# EAGLE board vr99-revA (EAGLE 9.6.2), part 1 of 5
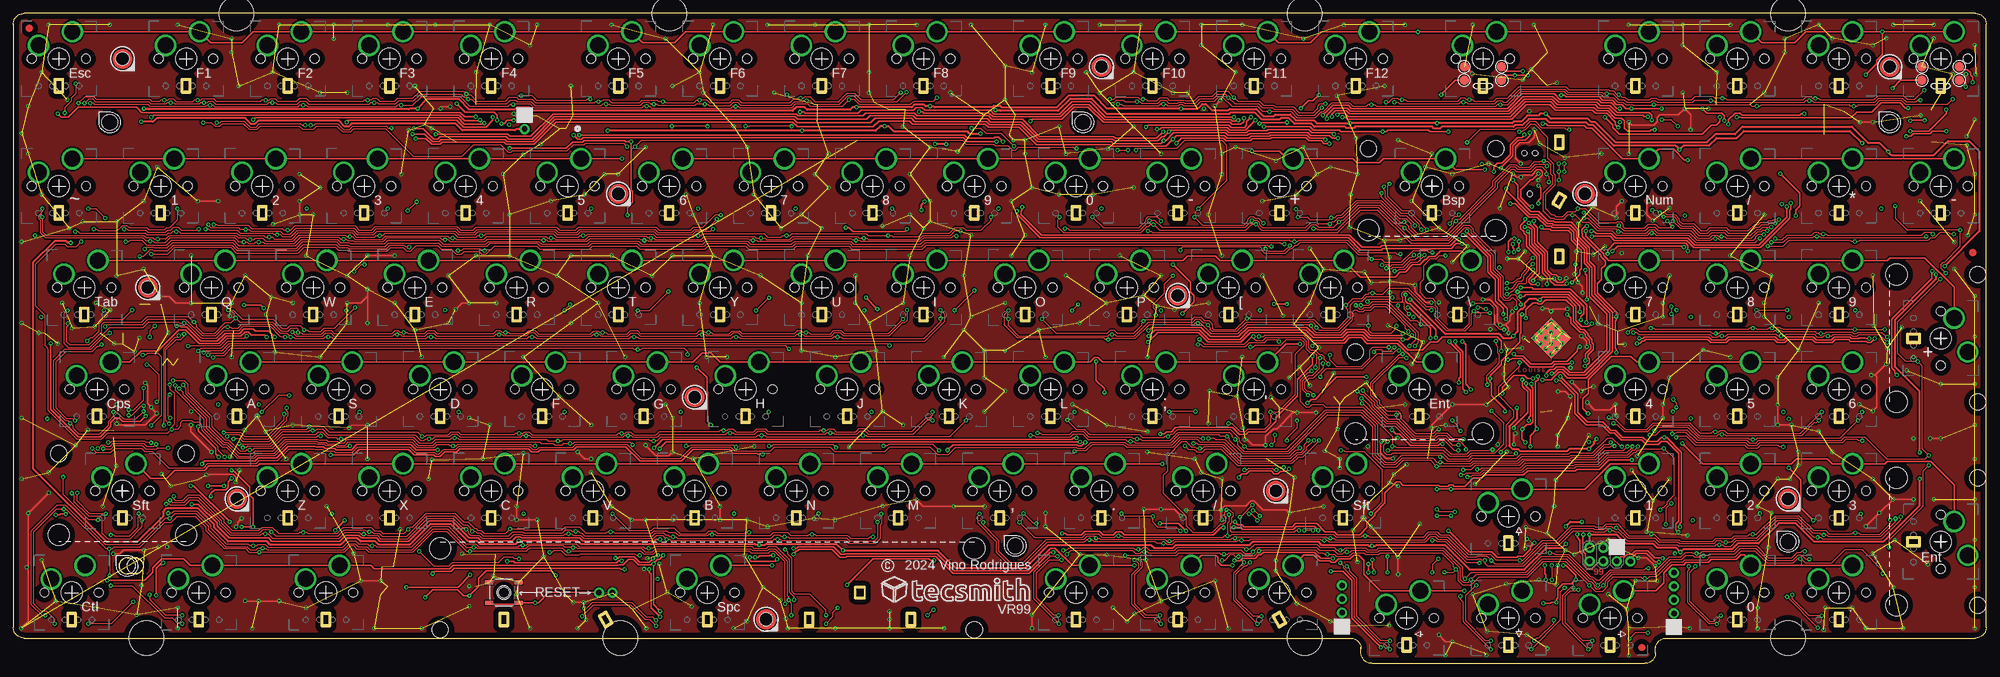
[diagram p4: board, top side]
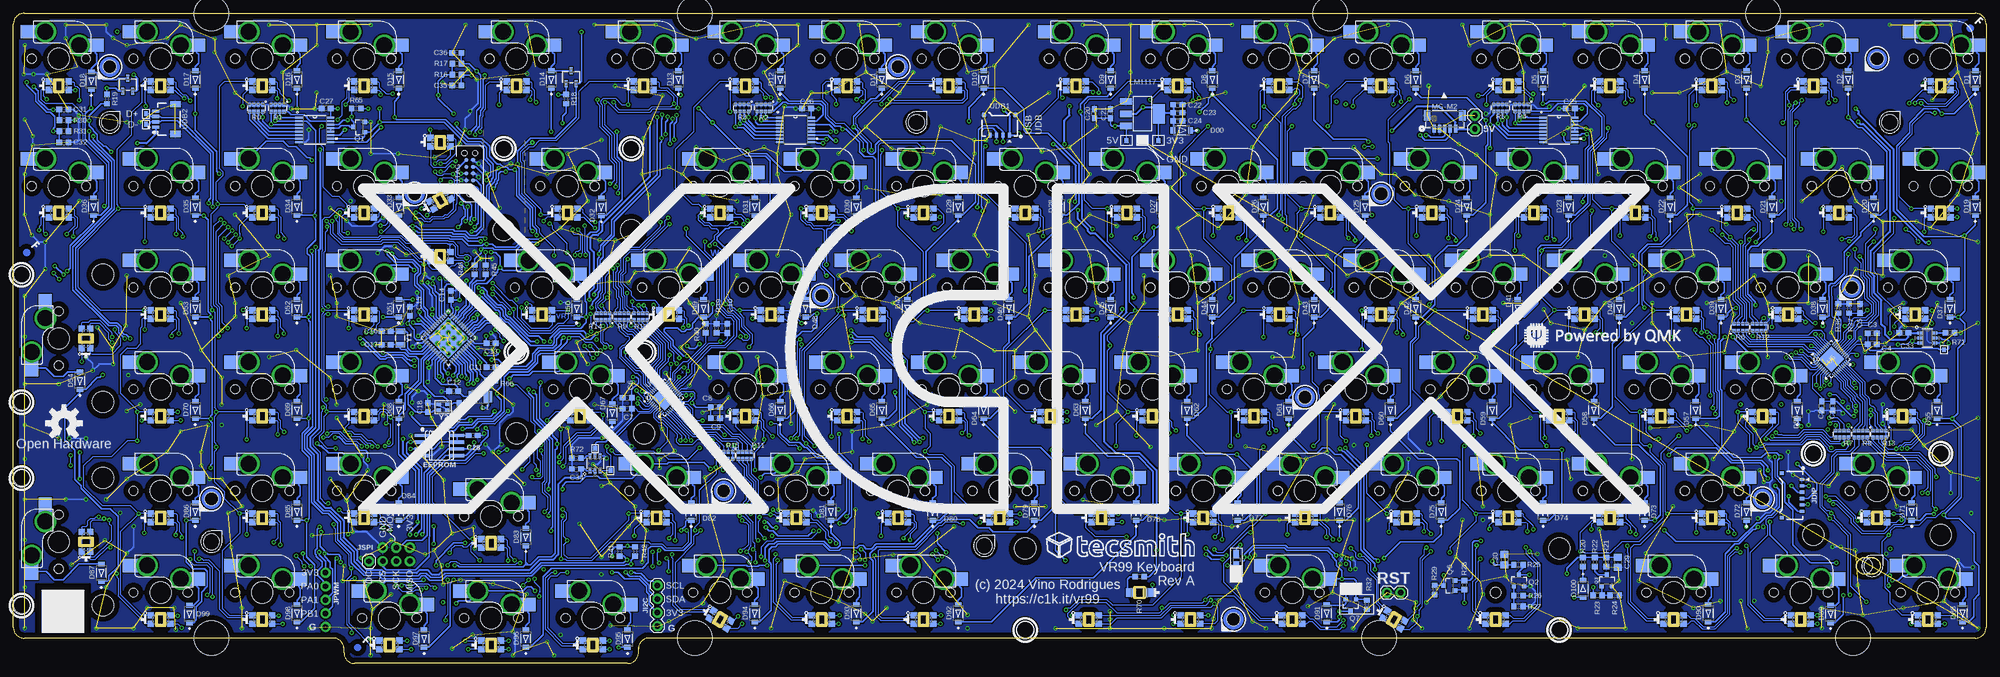
[diagram p5: board, bottom side, seen from below]

Size 369.48 x 121.83 mm. Coordinates in mm from the lower left corner, seen from the top.
Outline: 252.41,2.76 252.41,2 arc90 254.41,0 305.56,0 arc90 307.56,2 307.56,2.76
Outline: 252.41,2.76 252.41,3
Outline: 307.56,2.76 307.56,3
Outline: 307.56,2.76 arc-90 309.56,4.76 367.48,4.76 arc90 369.48,6.76 369.48,119.83 arc90 367.48,121.83 2,121.83 arc90 0,119.83 0,6.76 arc90 2,4.76 250.41,4.76 arc-90 252.41,2.76
Outline: 22.81,16.79 21.31,16.79 arc-180 21.31,19.79 22.81,19.79 arc-180 22.81,16.79
Copper layers (1*16): Top 0.035mm / dielectric 1.5mm / Bottom 0.035mm
Design rules "default *": minimum track width 6mil, minimum drill 0.35mm, track to track 9.5mil, track to pad 9.5mil, pad to pad 9.5mil, via to via 9.5mil, smd to smd 9.5mil, copper to edge 40mil, drill to drill 4mil, minimum pad ring 10mil, minimum via ring 8mil, stop-mask expansion 4mil, vias tented up to drill 0mil, thermal gap 9.5mil
Holes 6.5 mm at 332.38,121.8 241.89,121.8 122.83,121.8 41.83,121.8 332.38,4.79 241.89,4.79 113.72,4.79 24.97,4.79
Holes 2 mm at 91.87,13.29
Holes 3 mm at 22.81,18.29

## Footprints (pad centres in the part's own frame; a part is rotated, then mirrored left to right if it is on the bottom)
1X02 = drill 1.016 pad 1.88: 1 0,0; 2 2.54,0
C0603 = smd 1.1 x 1: 1 -0.85,0; 2 0.85,0
0603 = smd 1.1 x 1: 1 -0.85,0; 2 0.85,0
C0805 = smd 1.3 x 1.5: 1 -0.95,0; 2 0.95,0
SOD-123 = smd 0.914 x 1.219: A 1.638,0; C -1.638,0
LED-RM-MILL = smd 1.5 x 1.6: A 1.8,0; C -1.8,0
8-SOIC-SO8_N_W_DUAL = smd 0.6 x 2.731: 1 -1.905,-3.29; 2 -0.635,-3.29; 3 0.635,-3.29; 4 1.905,-3.29; 5 1.905,3.29; 6 0.635,3.29; 7 -0.635,3.29; 8 -1.905,3.29
MGEEK-M2-HOLE = hole 3: 0,0
BRUTAL-1800-HOLE = hole 2.5: 0,0
MX-STABS-200U = hole 3.988: -11.938,8.255; 11.938,8.255 | hole 3.048: -11.938,-6.985; 11.938,-6.985
MX-STABS-625U = hole 3.988: -50,8.255; 50,8.255 | hole 3.048: -50,-6.985; 50,-6.985
MOLEX_781710006 = smd 0.6 x 0.85: 1 -3,2; 2 -1.8,2; 3 -0.6,2; 4 0.6,2; 5 1.8,2; 6 3,2 | smd 0.7 x 0.8: NC1 -4.15,-1.775; NC2 4.15,-1.775
1X04 = drill 1.016 pad 1.88: 1 0,0; 2 2.54,0; 3 5.08,0; 4 7.62,0
1X05_NO_SILK = drill 1.016 pad 1.88: 1 0,0; 2 2.54,0; 3 5.08,0; 4 7.62,0; 5 10.16,0
2X3-NS = drill 1.016 pad 1.88: 1 -2.54,-1.27; 2 -2.54,1.27; 3 0,-1.27; 4 0,1.27; 5 2.54,-1.27; 6 2.54,1.27
1X01 = drill 1.016 pad 1.88: 1 0,0
TC2050-IDC-NL = smd 0.787 x 0.787: 1 1.27,-0.635; 2 2.54,-0.635; 3 3.81,-0.635; 4 5.08,-0.635; 5 6.35,-0.635; 6 6.35,0.635; 7 5.08,0.635; 8 3.81,0.635; 9 2.54,0.635; 10 1.27,0.635 | hole 1: 0,0; 7.62,-1.016; 7.62,1.016
L3225M = smd 1.6 x 2.2: 1 -1.4,0; 2 1.4,0
SOT223 = smd 1.219 x 2.235: 1 -2.311,-3.099; 2 0,-3.099; 3 2.311,-3.099 | smd 3.6 x 2.2: 4 0,3.099
CONN5_SM05B-SRSS_JST = smd 0.66 x 1.549: 1 -2,-1.772; 2 -1,-1.772; 3 0,-1.772; 4 1,-1.772; 5 2,-1.772 | smd 1.295 x 1.905: 6 -3.3,0.698; 7 3.3,0.698
SOT23-3 = smd 0.8 x 0.9: 1 -0.95,-1; 2 0.95,-1; 3 0,1.1
SOT-23-3L_AOS = smd 0.559 x 1.321: 1 -0.953,-1.194; 2 0.953,-1.194; 3 0,1.194
R0603X4 = smd 0.7 x 0.6: 1 -0.65,1.2; 2 -0.65,0.4; 3 -0.65,-0.4; 4 -0.65,-1.2; 5 0.65,-1.2; 6 0.65,-0.4; 7 0.65,0.4; 8 0.65,1.2
R0603 = smd 1 x 1.1: 1 -0.85,0; 2 0.85,0
R0805W = smd 1.5 x 1: 1 -1.052,0; 2 1.052,0
TACTILE_SWITCH_SMD_5.2MM = smd 1.524 x 0.762: 1 -2.794,1.905; 2 2.794,1.905; 3 -2.794,-1.905; 4 2.794,-1.905
MX-5-PIN-HOTSWAP-PAD = smd 3.15 x 2.5 bottom: 1@1 -6.785,2.54; 2@1 5.542,5.08 | drill 3 pad 3.75: 1@2 -3.81,2.54; 2@2 2.54,5.08 | hole 3.988: 0,0 | hole 1.7: -5.08,0; 5.08,0
MX-5-PIN-SKYLOONG-KNOB = smd 3.15 x 2.5 bottom: 1@1 -6.785,2.54; 2@1 5.542,5.08 | drill 3 pad 3.75: 1@2 -3.81,2.54; 2@2 2.54,5.08 | smd 1.75 x 1.75: A 3.5,-4; B 3.5,-1.5; C -3.5,-1.5; S -3.5,-4 | hole 3.988: 0,0 | hole 1.7: -5.08,0; 5.08,0
PAD.03X.03-SQ = smd 0.762 x 0.762: 1 0,0
UFQFPN-48_7X7X0P55MM-THERM = smd 0.813 x 0.305: 1 -3.454,2.75; 2 -3.454,2.25; 3 -3.454,1.75; 4 -3.454,1.25; 5 -3.454,0.75; 6 -3.454,0.25; 7 -3.454,-0.25; 8 -3.454,-0.75; 9 -3.454,-1.25; 10 -3.454,-1.75; 11 -3.454,-2.25; 12 -3.454,-2.75; 25 3.454,-2.75; 26 3.454,-2.25; 27 3.454,-1.75; 28 3.454,-1.25; 29 3.454,-0.75; 30 3.454,-0.25; 31 3.454,0.25; 32 3.454,0.75; 33 3.454,1.25; 34 3.454,1.75; 35 3.454,2.25; 36 3.454,2.75 | smd 0.305 x 0.813: 13 -2.75,-3.454; 14 -2.25,-3.454; 15 -1.75,-3.454; 16 -1.25,-3.454; 17 -0.75,-3.454; 18 -0.25,-3.454; 19 0.25,-3.454; 20 0.75,-3.454; 21 1.25,-3.454; 22 1.75,-3.454; 23 2.25,-3.454; 24 2.75,-3.454; 37 2.75,3.454; 38 2.25,3.454; 39 1.75,3.454; 40 1.25,3.454; 41 0.75,3.454; 42 0.25,3.454; 43 -0.25,3.454; 44 -0.75,3.454; 45 -1.25,3.454; 46 -1.75,3.454; 47 -2.25,3.454; 48 -2.75,3.454 | smd 5 x 5.4: 49 0.2,0 | smd 0.4 x 5: 49@1 -2.5,-0.2 | smd 0.56 x 0.29 rotated 45: 49@2 -2.4,2.4 | smd 5.4 x 5.4 bottom: 49@3 0,0 | drill 0.4: 49@4 -0.711,2.134; 49@5 0.711,2.134; 49@6 2.134,2.134; 49@7 -2.134,0.711; 49@8 -0.711,0.711; 49@9 0.711,0.711; 49@10 2.134,0.711; 49@11 -2.134,-0.711; 49@12 -0.711,-0.711; 49@13 0.711,-0.711; 49@14 2.134,-0.711; 49@15 -2.134,-2.134; 49@16 -0.711,-2.134; 49@17 0.711,-2.134; 49@18 2.134,-2.134
TSSOP16 = smd 1.408 x 0.356: 1 -2.952,2.275; 2 -2.952,1.625; 3 -2.952,0.975; 4 -2.952,0.325; 5 -2.952,-0.325; 6 -2.952,-0.975; 7 -2.952,-1.625; 8 -2.952,-2.275; 9 2.952,-2.275; 10 2.952,-1.625; 11 2.952,-0.975; 12 2.952,-0.325; 13 2.952,0.325; 14 2.952,0.975; 15 2.952,1.625; 16 2.952,2.275
UQFN40 = smd 0.813 x 0.203: 1 -2.4,1.8; 2 -2.4,1.4; 3 -2.4,1; 4 -2.4,0.6; 5 -2.4,0.2; 6 -2.4,-0.2; 7 -2.4,-0.6; 8 -2.4,-1; 9 -2.4,-1.4; 10 -2.4,-1.8; 21 2.4,-1.8; 22 2.4,-1.4; 23 2.4,-1; 24 2.4,-0.6; 25 2.4,-0.2; 26 2.4,0.2; 27 2.4,0.6; 28 2.4,1; 29 2.4,1.4; 30 2.4,1.8 | smd 0.203 x 0.813: 11 -1.8,-2.4; 12 -1.4,-2.4; 13 -1,-2.4; 14 -0.6,-2.4; 15 -0.2,-2.4; 16 0.2,-2.4; 17 0.6,-2.4; 18 1,-2.4; 19 1.4,-2.4; 20 1.8,-2.4; 31 1.8,2.4; 32 1.4,2.4; 33 1,2.4; 34 0.6,2.4; 35 0.2,2.4; 36 -0.2,2.4; 37 -0.6,2.4; 38 -1,2.4; 39 -1.4,2.4; 40 -1.8,2.4 | smd 3 x 3.4: EPAD 0.225,0 | smd 0.566 x 0.566 rotated 315: EPAD@1 -1.278,1.299 | smd 0.4 x 3: EPAD@2 -1.477,-0.2
SOT-23-THIN-6_DDC_TEX = smd 1.003 x 0.559: 1 -1.378,0.95; 2 -1.378,0; 3 -1.378,-0.95; 4 1.378,-0.95; 5 1.378,0; 6 1.378,0.95
MOLEX_781710004 = smd 0.6 x 0.85: 1 -1.8,2; 2 -0.6,2; 3 0.6,2; 4 1.8,2 | smd 0.7 x 0.8: NC1 -2.95,-1.775; NC2 2.95,-1.775
JST_SM04B-SRSS-TB_LF_SN = smd 0.6 x 1.35: 1 -1.5,0; 2 -0.5,0; 3 0.5,0; 4 1.5,0 | smd 1.2 x 2: NC1 2.8,-3.675; NC2 -2.8,-3.675
CRYSTAL-SMD-3.2X1.5MM = smd 1 x 1.8: P$1 -1.25,0; P$2 1.25,0
CRYSTAL_2.5X2 = smd 0.9 x 0.75: 1 -0.825,-0.625; 2 0.825,-0.625; 3 0.825,0.625; 4 -0.825,0.625
156120M173000-MILL = smd 1.2 x 1.2: 1 -1.85,0.8; 2 -1.85,-0.8; 3 1.85,-0.8; 4 1.85,0.8

## Placement (x,y rotation side)
5V  [1X02]  95.75,100.15 90 bottom
C1  1uF  [C0603]  28.73,48.25 90 bottom
C2  0.1uF  [C0603]  30.77,48.25 90 bottom
C3  1uF  [C0603]  21.3,61.9 180 bottom
C4  0.1uF  [C0603]  21.3,59.83 180 bottom
C5  0.1uF  [C0603]  23.65,66.53 270 bottom
C6  1uF  [C0603]  254.5,49.8 0 bottom
C7  0.1uF  [C0603]  254.5,47.77 0 bottom
C8  1uF  [C0603]  238,48 180 bottom
C9  0.1uF  [C0603]  238,45.98 180 bottom
C10  0.1uF  [C0603]  235.78,62.8 270 bottom
C11  22uF  [C0603]  280,55.5 0 bottom
C12  100nF  [C0603]  287,51 180 bottom
C13  100nF  [C0603]  280,60 0 bottom
C14  100nF  [C0603]  287.5,69 90 bottom
C15  100nF  [C0603]  295.23,66 90 bottom
C16  4.3pF  [C0603]  299.65,62.25 180 bottom
C17  4.3pF  [C0603]  299.65,59.75 180 bottom
C18  12pF  [C0603]  291.85,48 90 bottom
C19  12pF  [C0603]  286,48 270 bottom
C20  22uF  [0603]  167,103 90 bottom
C21  100nF  [0603]  164,103 90 bottom
C22  100nF  [0603]  151.4,104.7 0 bottom
C23  22uF  [0603]  151.4,103.2 0 bottom
C24  4.7uF  [0603]  151.4,101.7 0 bottom
C25  100nF  [0603]  77.9,104 180 bottom
C26  100nF  [0603]  220.9,104 180 bottom
C27  100nF  [0603]  310.9,104 180 bottom
C28  100nF  [0603]  283.35,42.75 0 bottom
C29  10uF  [C0805]  68.95,18.95 270 bottom
C30  100nF  [C0805]  90.2,19.48 270 bottom
C31  100nF  [C0603]  360,103.8 0 bottom
C32  100nF  [C0603]  360,97.67 0 bottom
C33  1uF  [C0603]  15.42,61.95 0 bottom
C34  1uF  [C0603]  264.02,36.45 0 bottom
C35  100nF  [C0603]  286.43,108.3 180 bottom
C36  100nF  [C0603]  286.43,114.42 180 bottom
D00  B5819W SL  [SOD-123]  150.65,99.9 180 bottom
D1  [SOD-123]  2.03,109.43 90 bottom
D2  [SOD-123]  25.84,109.43 90 bottom
D3  [SOD-123]  44.89,109.43 90 bottom
D4  [SOD-123]  63.94,109.43 90 bottom
D5  [SOD-123]  82.99,109.43 90 bottom
D6  [SOD-123]  106.81,109.43 90 bottom
D7  [SOD-123]  125.86,109.43 90 bottom
D8  [SOD-123]  144.91,109.43 90 bottom
D9  [SOD-123]  163.96,109.43 90 bottom
D10  [SOD-123]  187.77,109.43 90 bottom
D11  [SOD-123]  206.82,109.43 90 bottom
D12  [SOD-123]  225.87,109.43 90 bottom
D13  [SOD-123]  244.92,109.43 90 bottom
D14  [SOD-123]  268.73,109.43 90 bottom
D15  [SOD-123]  297.31,109.43 90 bottom
D16  [SOD-123]  316.36,109.43 90 bottom
D17  [SOD-123]  335.41,109.43 90 bottom
D18  [SOD-123]  354.88,109.2 90 bottom
D19  [SOD-123]  2.03,85.61 90 bottom
D20  [SOD-123]  21.08,85.61 90 bottom
D21  [SOD-123]  40.13,85.61 90 bottom
D22  [SOD-123]  59.18,85.61 90 bottom
D23  [SOD-123]  78.23,85.61 90 bottom
D24  [SOD-123]  97.28,85.61 90 bottom
D25  [SOD-123]  116.33,85.61 90 bottom
D26  [SOD-123]  135.38,85.61 90 bottom
D27  [SOD-123]  154.43,85.61 90 bottom
D28  [SOD-123]  173.48,85.61 90 bottom
D29  [SOD-123]  192.53,85.61 90 bottom
D30  [SOD-123]  211.58,85.61 90 bottom
D31  [SOD-123]  230.63,85.61 90 bottom
D32  [SOD-123]  259.36,85.54 90 bottom
D33  [SOD-123]  297.31,85.61 90 bottom
D34  [SOD-123]  316.36,85.61 90 bottom
D35  [SOD-123]  335.41,85.61 90 bottom
D36  [SOD-123]  354.46,85.61 90 bottom
D37  [SOD-123]  6.79,66.56 90 bottom
D38  [SOD-123]  30.61,66.56 90 bottom
D39  [SOD-123]  49.66,66.56 90 bottom
D40  [SOD-123]  68.71,66.56 90 bottom
D41  [SOD-123]  87.76,66.56 90 bottom
D42  [SOD-123]  106.81,66.56 90 bottom
D43  [SOD-123]  125.86,66.56 90 bottom
D44  [SOD-123]  144.91,66.56 90 bottom
D45  [SOD-123]  163.96,66.56 90 bottom
D46  [SOD-123]  183.01,66.56 90 bottom
D47  [SOD-123]  202.06,66.56 90 bottom
D48  [SOD-123]  221.11,66.56 90 bottom
D49  [SOD-123]  240.21,66.56 90 bottom
D50  [SOD-123]  263.97,66.56 90 bottom
D51  [SOD-123]  297.31,66.56 90 bottom
D52  [SOD-123]  316.36,66.56 90 bottom
D53  [SOD-123]  335.41,66.56 90 bottom
D54  [SOD-123]  357,53 90 bottom
D55  [SOD-123]  9.18,47.52 90 bottom
D56  [SOD-123]  35.37,47.52 90 bottom
D57  [SOD-123]  54.42,47.52 90 bottom
D58  [SOD-123]  73.47,47.52 90 bottom
D59  [SOD-123]  92.52,47.52 90 bottom
D60  [SOD-123]  111.57,47.52 90 bottom
D61  [SOD-123]  130.62,47.52 90 bottom
D62  [SOD-123]  149.67,47.52 90 bottom
D63  [SOD-123]  168.72,47.52 90 bottom
D64  [SOD-123]  187.77,47.52 90 bottom
D65  [SOD-123]  206.82,47.52 90 bottom
D66  [SOD-123]  225.87,47.52 90 bottom
D67  [SOD-123]  257.32,47.02 90 bottom
D68  [SOD-123]  297.31,47.52 90 bottom
D69  [SOD-123]  316.36,47.52 90 bottom
D70  [SOD-123]  335.41,47.52 90 bottom
D71  [SOD-123]  13.94,28.46 90 bottom
D72  [SOD-123]  44.89,28.46 90 bottom
D73  [SOD-123]  63.94,28.46 90 bottom
D74  [SOD-123]  82.99,28.46 90 bottom
D75  [SOD-123]  102.04,28.46 90 bottom
D76  [SOD-123]  121.09,28.46 90 bottom
D77  [SOD-123]  140.14,28.46 90 bottom
D78  [SOD-123]  159.19,28.46 90 bottom
D79  [SOD-123]  178.24,28.46 90 bottom
D80  [SOD-123]  197.29,28.46 90 bottom
D81  [SOD-123]  216.34,28.46 90 bottom
D82  [SOD-123]  242.54,28.46 90 bottom
D83  [SOD-123]  273.49,23.7 90 bottom
D84  [SOD-123]  297.31,28.46 90 bottom
D85  [SOD-123]  316.36,28.46 90 bottom
D86  [SOD-123]  335.41,28.46 90 bottom
D87  [SOD-123]  353,17 90 bottom
D88  [SOD-123]  4.41,9.41 90 bottom
D89  [SOD-123]  29.12,9.29 90 bottom
D90  [SOD-123]  52.04,9.41 90 bottom
D91  [SOD-123]  123.47,9.41 90 bottom
D92  [SOD-123]  192.53,9.41 90 bottom
D93  [SOD-123]  211.58,9.41 90 bottom
D94  [SOD-123]  230.63,9.41 90 bottom
D95  [SOD-123]  254.44,4.65 90 bottom
D96  [SOD-123]  273.49,4.65 90 bottom
D97  [SOD-123]  292.54,4.65 90 bottom
D98  [SOD-123]  316.36,9.41 90 bottom
D99  [SOD-123]  336.51,9.29 90 bottom
D100  1N4148  [SOD-123]  75.5,14 270 bottom
D107  BLUE  [LED-RM-MILL]  158.54,13.29 180 bottom
EEPROM  M25CDUAL  [8-SOIC-SO8_N_W_DUAL]  289.69,40.85 270 bottom
G1  MGEEK-M2-HOLE  [MGEEK-M2-HOLE]  18.05,101.39 0 top
G2  MGEEK-M2-HOLE  [MGEEK-M2-HOLE]  200.34,101.39 0 top
G3  MGEEK-M2-HOLE  [MGEEK-M2-HOLE]  351.43,101.39 0 top
G4  MGEEK-M2-HOLE  [MGEEK-M2-HOLE]  332.38,22.81 0 top
G5  MGEEK-M2-HOLE  [MGEEK-M2-HOLE]  187.65,22.05 0 top
G6  MGEEK-M2-HOLE  [MGEEK-M2-HOLE]  21.31,18.29 0 top
H1  BRURAL-1800-HOLE  [BRUTAL-1800-HOLE]  351.43,111.8 0 top
H2  BRURAL-1800-HOLE  [BRUTAL-1800-HOLE]  203.79,111.8 0 top
H3  BRURAL-1800-HOLE  [BRUTAL-1800-HOLE]  20.43,113.3 0 top
H4  BRURAL-1800-HOLE  [BRUTAL-1800-HOLE]  294.3,87.99 0 top
H5  BRURAL-1800-HOLE  [BRUTAL-1800-HOLE]  113.3,87.99 0 top
H6  BRURAL-1800-HOLE  [BRUTAL-1800-HOLE]  218.07,68.94 0 top
H7  BRURAL-1800-HOLE  [BRUTAL-1800-HOLE]  25.19,70.44 0 top
H8  BRURAL-1800-HOLE  [BRUTAL-1800-HOLE]  127.59,49.89 0 top
H9  BRURAL-1800-HOLE  [BRUTAL-1800-HOLE]  332.38,30.84 0 top
H10  BRURAL-1800-HOLE  [BRUTAL-1800-HOLE]  236.43,32.34 0 top
H11  BRURAL-1800-HOLE  [BRUTAL-1800-HOLE]  140.97,8.29 0 top
H12  BRURAL-1800-HOLE  [BRUTAL-1800-HOLE]  41.89,30.84 0 top
H_BSP  MX-STABS-200U  [MX-STABS-200U]  265.7,89.49 180 top
H_ENT  MX-STABS-200U  [MX-STABS-200U]  263.32,51.39 180 top
H_LS  MX-STABS-200U  [MX-STABS-200U]  20.43,32.34 180 top
H_NEN  MX-STABS-200U  [MX-STABS-200U]  360.95,22.81 90 top
H_NP  MX-STABS-200U  [MX-STABS-200U]  360.95,60.91 90 top
H_SPC  MX-STABS-625U  [MX-STABS-625U]  129.97,13.29 0 top
JDIP  MOLEX_0781710006  [MOLEX_781710006]  36.5,31.5 270 bottom
JI2C  [1X04]  248.84,14.62 270 bottom
JPWM  [1X05_NO_SILK]  311,17 270 top
JSPI  DNP  [2X3-NS]  297.75,20.45 0 top
JSPI@2  [1X01]  302.85,19.15 270 bottom
JTAG  TC2050IDC-NL  [TC2050-IDC-NL]  284,88 90 bottom
L1  10uH ±10%  [L3225M]  282,50 0 bottom
LM1117  AMS1117-3.3  [SOT223]  158,103 270 bottom
LOGO1  OSHW-LOGOL  [OSHW-LOGO-L]  360,45 0 bottom
M_M2  SM05B-SRSS-TB(LF)(SN)  [CONN5_SM05B-SRSS_JST]  101.39,102 0 bottom
Q1  2N7002  [SOT23-3]  304.68,100.53 90 bottom
Q2  2N7002  [SOT23-3]  87.5,15.5 0 bottom
Q3  2N7002  [SOT23-3]  71.05,15.5 0 bottom
Q4  AO3401A  [SOT-23-3L_AOS]  265,109.85 0 bottom
Q5  AO3401A  [SOT-23-3L_AOS]  348.05,108.47 0 bottom
Q6  BSH201  [SOT23-3]  100.5,14.6 90 bottom
Q7  2N7002  [SOT23-3]  119,11 180 bottom
R0  10K  [R0603X4]  324,104.05 270 bottom
R1  10K  [R0603X4]  320,104.05 270 bottom
R2  10K  [R0603X4]  229,104.1 270 bottom
R3  10K  [R0603X4]  233,104.1 270 bottom
R4  10K  [R0603X4]  87,104.1 270 bottom
R5  10K  [R0603X4]  91,104.1 270 bottom
R6  20R  [R0603X4]  46,63 90 bottom
R7  20R  [R0603X4]  27,43 270 bottom
R8  20R  [R0603X4]  23.5,43 270 bottom
R9  20R  [R0603X4]  255.5,65 90 bottom
R10  20R  [R0603X4]  252,65 90 bottom
R11  20R  [R0603X4]  232.5,39 270 bottom
R12  51R  [R0603X4]  42.5,63 90 bottom
R13  51R  [R0603X4]  20,43 270 bottom
R14  51R  [R0603X4]  259,65 90 bottom
R15  51R  [R0603X4]  236,39 270 bottom
R16  5.1K  [R0603]  286.43,110.35 180 bottom
R17  5.1K  [R0603]  286.43,112.4 180 bottom
R18  10K  [R0603]  265.95,105.75 270 bottom
R19  10K  [R0603]  351.95,105.75 270 bottom
R20  330K  [R0603]  75.5,19 270 bottom
R21  1M  [R0603]  71.1,19 90 bottom
R22  10K  [R0603]  73.3,19 90 bottom
R23  10K  [R0603]  72.75,12.75 180 bottom
R24  100K  [R0603]  69.55,12.75 0 bottom
R25  100R  [R0603]  87.6,18.5 180 bottom
R26  1K  [R0603]  87.6,12.72 0 bottom
R27  10K  [R0603]  87.6,10.7 0 bottom
R28  100K  [R0603]  97.7,14.7 270 bottom
R29  100K  [R0603]  103.3,13.8 90 bottom
R30  5.1K  [R0603]  360,101.78 0 bottom
R31  5.1K  [R0603]  360,99.72 0 bottom
R32  10K  [R0603]  116,11 270 bottom
R33@1  0R  [R0805W]  140.43,19.45 270 bottom
R33@2  0R-DNP  [R0805W]  140.43,17.35 270 bottom
R34  0R-DNP  [R0805W]  119,14.03 180 bottom
R37  100K  [R0603]  25.68,66.53 270 bottom
R38  10K  [R0603]  27.73,66.53 270 bottom
R39  100K  [R0603]  237.8,62.8 270 bottom
R40  10K  [R0603]  239.82,62.8 270 bottom
R41  4K7  [R0603]  255.93,21 90 bottom
R42  4K7  [R0603]  253,21 90 bottom
R45  10R  [R0603]  281.02,73.8 270 bottom
R46  10R  [R0603]  283.05,73.8 270 bottom
R65  5.1K  [R0603]  305.25,104 0 bottom
R66  10K  [R0603]  280,53 180 bottom
R70  1K  [R0603]  158.54,16.29 180 bottom
R71  1K  [R0603]  6.75,61.97 180 bottom
R72  1K  [R0603]  264.02,38.48 0 bottom
RST  [1X02]  112.21,13.29 0 bottom
S1  Reset  [TACTILE_SWITCH_SMD_5.2MM]  91.87,13.29 0 top
SW_0  MX-5-PIN-HOTSWAP-PAD  [MX-5-PIN-HOTSWAP-PAD]  199.03,89.49 0 top
SW_1  MX-5-PIN-HOTSWAP-PAD  [MX-5-PIN-HOTSWAP-PAD]  27.57,89.49 0 top
SW_2  MX-5-PIN-HOTSWAP-PAD  [MX-5-PIN-HOTSWAP-PAD]  46.62,89.49 0 top
SW_3  MX-5-PIN-HOTSWAP-PAD  [MX-5-PIN-HOTSWAP-PAD]  65.67,89.49 0 top
SW_4  MX-5-PIN-HOTSWAP-PAD  [MX-5-PIN-HOTSWAP-PAD]  84.72,89.49 0 top
SW_5  MX-5-PIN-HOTSWAP-PAD  [MX-5-PIN-HOTSWAP-PAD]  103.78,89.49 0 top
SW_6  MX-5-PIN-HOTSWAP-PAD  [MX-5-PIN-HOTSWAP-PAD]  122.83,89.49 0 top
SW_7  MX-5-PIN-HOTSWAP-PAD  [MX-5-PIN-HOTSWAP-PAD]  141.88,89.49 0 top
SW_8  MX-5-PIN-HOTSWAP-PAD  [MX-5-PIN-HOTSWAP-PAD]  160.93,89.49 0 top
SW_9  MX-5-PIN-HOTSWAP-PAD  [MX-5-PIN-HOTSWAP-PAD]  179.97,89.49 0 top
SW_A  MX-5-PIN-HOTSWAP-PAD  [MX-5-PIN-HOTSWAP-PAD]  41.86,51.39 0 top
SW_B  MX-5-PIN-HOTSWAP-PAD  [MX-5-PIN-HOTSWAP-PAD]  127.59,32.34 0 top
SW_BSP  MX-5-PIN-HOTSWAP-PAD  [MX-5-PIN-HOTSWAP-PAD]  265.7,89.49 0 top
SW_C  MX-5-PIN-HOTSWAP-PAD  [MX-5-PIN-HOTSWAP-PAD]  89.49,32.34 0 top
SW_CB  MX-5-PIN-HOTSWAP-PAD  [MX-5-PIN-HOTSWAP-PAD]  246.65,70.44 0 top
SW_CL  MX-5-PIN-HOTSWAP-PAD  [MX-5-PIN-HOTSWAP-PAD]  15.67,51.39 0 top
SW_CM  MX-5-PIN-HOTSWAP-PAD  [MX-5-PIN-HOTSWAP-PAD]  184.74,32.34 0 top
SW_CS  MX-5-PIN-HOTSWAP-PAD  [MX-5-PIN-HOTSWAP-PAD]  213.31,51.39 0 top
SW_D  MX-5-PIN-HOTSWAP-PAD  [MX-5-PIN-HOTSWAP-PAD]  79.96,51.39 0 top
SW_DN  MX-5-PIN-HOTSWAP-PAD  [MX-5-PIN-HOTSWAP-PAD]  279.99,8.53 0 top
SW_DP  MX-5-PIN-HOTSWAP-PAD  [MX-5-PIN-HOTSWAP-PAD]  270.46,70.44 0 top
SW_DSH  MX-5-PIN-HOTSWAP-PAD  [MX-5-PIN-HOTSWAP-PAD]  322.85,89.49 0 top
SW_DT  MX-5-PIN-HOTSWAP-PAD  [MX-5-PIN-HOTSWAP-PAD]  203.79,32.34 0 top
SW_E  MX-5-PIN-HOTSWAP-PAD  [MX-5-PIN-HOTSWAP-PAD]  75.2,70.44 0 top
SW_ENT  MX-5-PIN-HOTSWAP-PAD  [MX-5-PIN-HOTSWAP-PAD]  263.32,51.39 0 top
SW_EP  MX-5-PIN-HOTSWAP-PAD  [MX-5-PIN-HOTSWAP-PAD]  237.12,89.49 0 top
SW_ESC  MX-5-PIN-HOTSWAP-PAD  [MX-5-PIN-HOTSWAP-PAD]  8.53,113.3 0 top
SW_F  MX-5-PIN-HOTSWAP-PAD  [MX-5-PIN-HOTSWAP-PAD]  99.01,51.39 0 top
SW_F1  MX-5-PIN-HOTSWAP-PAD  [MX-5-PIN-HOTSWAP-PAD]  32.34,113.3 0 top
SW_F2  MX-5-PIN-HOTSWAP-PAD  [MX-5-PIN-HOTSWAP-PAD]  51.39,113.3 0 top
SW_F3  MX-5-PIN-HOTSWAP-PAD  [MX-5-PIN-HOTSWAP-PAD]  70.44,113.3 0 top
SW_F4  MX-5-PIN-HOTSWAP-PAD  [MX-5-PIN-HOTSWAP-PAD]  89.49,113.3 0 top
SW_F5  MX-5-PIN-HOTSWAP-PAD  [MX-5-PIN-HOTSWAP-PAD]  113.3,113.3 0 top
SW_F6  MX-5-PIN-HOTSWAP-PAD  [MX-5-PIN-HOTSWAP-PAD]  132.35,113.3 0 top
SW_F7  MX-5-PIN-HOTSWAP-PAD  [MX-5-PIN-HOTSWAP-PAD]  151.4,113.3 0 top
SW_F8  MX-5-PIN-HOTSWAP-PAD  [MX-5-PIN-HOTSWAP-PAD]  170.45,113.3 0 top
SW_F9  MX-5-PIN-HOTSWAP-PAD  [MX-5-PIN-HOTSWAP-PAD]  194.26,113.3 0 top
SW_F10  MX-5-PIN-HOTSWAP-PAD  [MX-5-PIN-HOTSWAP-PAD]  213.31,113.3 0 top
SW_F11  MX-5-PIN-HOTSWAP-PAD  [MX-5-PIN-HOTSWAP-PAD]  232.36,113.3 0 top
SW_F12  MX-5-PIN-HOTSWAP-PAD  [MX-5-PIN-HOTSWAP-PAD]  251.41,113.3 0 top
SW_F13  MX-5-PIN-SKYLOONG-KNOB  [MX-5-PIN-SKYLOONG-KNOB]  275.23,113.3 0 top
SW_F14  MX-5-PIN-HOTSWAP-PAD  [MX-5-PIN-HOTSWAP-PAD]  303.8,113.3 0 top
SW_F15  MX-5-PIN-HOTSWAP-PAD  [MX-5-PIN-HOTSWAP-PAD]  322.85,113.3 0 top
SW_F16  MX-5-PIN-HOTSWAP-PAD  [MX-5-PIN-HOTSWAP-PAD]  341.9,113.3 0 top
SW_F17  MX-5-PIN-SKYLOONG-KNOB  [MX-5-PIN-SKYLOONG-KNOB]  360.95,113.3 0 top
SW_FS  MX-5-PIN-HOTSWAP-PAD  [MX-5-PIN-HOTSWAP-PAD]  222.84,32.34 0 top
SW_G  MX-5-PIN-HOTSWAP-PAD  [MX-5-PIN-HOTSWAP-PAD]  118.06,51.39 0 top
SW_H  MX-5-PIN-HOTSWAP-PAD  [MX-5-PIN-HOTSWAP-PAD]  137.11,51.39 0 top
SW_I  MX-5-PIN-HOTSWAP-PAD  [MX-5-PIN-HOTSWAP-PAD]  170.45,70.44 0 top
SW_J  MX-5-PIN-HOTSWAP-PAD  [MX-5-PIN-HOTSWAP-PAD]  156.16,51.39 0 top
SW_K  MX-5-PIN-HOTSWAP-PAD  [MX-5-PIN-HOTSWAP-PAD]  175.21,51.39 0 top
SW_L  MX-5-PIN-HOTSWAP-PAD  [MX-5-PIN-HOTSWAP-PAD]  194.26,51.39 0 top
SW_LA  MX-5-PIN-HOTSWAP-PAD  [MX-5-PIN-HOTSWAP-PAD]  58.53,13.29 0 top
SW_LC  MX-5-PIN-HOTSWAP-PAD  [MX-5-PIN-HOTSWAP-PAD]  10.91,13.29 0 top
SW_LF  MX-5-PIN-HOTSWAP-PAD  [MX-5-PIN-HOTSWAP-PAD]  260.94,8.53 0 top
SW_LS  MX-5-PIN-HOTSWAP-PAD  [MX-5-PIN-HOTSWAP-PAD]  20.43,32.34 0 top
SW_LW  MX-5-PIN-HOTSWAP-PAD  [MX-5-PIN-HOTSWAP-PAD]  34.72,13.29 0 top
SW_M  MX-5-PIN-HOTSWAP-PAD  [MX-5-PIN-HOTSWAP-PAD]  165.69,32.34 0 top
SW_MIN  MX-5-PIN-HOTSWAP-PAD  [MX-5-PIN-HOTSWAP-PAD]  360.95,89.49 0 top
SW_MU  MX-5-PIN-HOTSWAP-PAD  [MX-5-PIN-HOTSWAP-PAD]  218.07,89.49 0 top
SW_MUL  MX-5-PIN-HOTSWAP-PAD  [MX-5-PIN-HOTSWAP-PAD]  341.9,89.49 0 top
SW_N  MX-5-PIN-HOTSWAP-PAD  [MX-5-PIN-HOTSWAP-PAD]  146.64,32.34 0 top
SW_N0  MX-5-PIN-HOTSWAP-PAD  [MX-5-PIN-HOTSWAP-PAD]  322.85,13.29 0 top
SW_N1  MX-5-PIN-HOTSWAP-PAD  [MX-5-PIN-HOTSWAP-PAD]  303.8,32.34 0 top
SW_N2  MX-5-PIN-HOTSWAP-PAD  [MX-5-PIN-HOTSWAP-PAD]  322.85,32.34 0 top
SW_N3  MX-5-PIN-HOTSWAP-PAD  [MX-5-PIN-HOTSWAP-PAD]  341.9,32.34 0 top
SW_N4  MX-5-PIN-HOTSWAP-PAD  [MX-5-PIN-HOTSWAP-PAD]  303.8,51.39 0 top
SW_N5  MX-5-PIN-HOTSWAP-PAD  [MX-5-PIN-HOTSWAP-PAD]  322.85,51.39 0 top
SW_N6  MX-5-PIN-HOTSWAP-PAD  [MX-5-PIN-HOTSWAP-PAD]  341.9,51.39 0 top
SW_N7  MX-5-PIN-HOTSWAP-PAD  [MX-5-PIN-HOTSWAP-PAD]  303.8,70.44 0 top
SW_N8  MX-5-PIN-HOTSWAP-PAD  [MX-5-PIN-HOTSWAP-PAD]  322.85,70.44 0 top
SW_N9  MX-5-PIN-HOTSWAP-PAD  [MX-5-PIN-HOTSWAP-PAD]  341.9,70.44 0 top
SW_ND  MX-5-PIN-HOTSWAP-PAD  [MX-5-PIN-HOTSWAP-PAD]  341.9,13.29 0 top
SW_NEN  MX-5-PIN-HOTSWAP-PAD  [MX-5-PIN-HOTSWAP-PAD]  360.95,22.81 270 top
SW_NP  MX-5-PIN-HOTSWAP-PAD  [MX-5-PIN-HOTSWAP-PAD]  360.95,60.91 270 top
SW_NUM  MX-5-PIN-HOTSWAP-PAD  [MX-5-PIN-HOTSWAP-PAD]  303.8,89.49 0 top
SW_O  MX-5-PIN-HOTSWAP-PAD  [MX-5-PIN-HOTSWAP-PAD]  189.5,70.44 0 top
SW_OB  MX-5-PIN-HOTSWAP-PAD  [MX-5-PIN-HOTSWAP-PAD]  227.6,70.44 0 top
SW_P  MX-5-PIN-HOTSWAP-PAD  [MX-5-PIN-HOTSWAP-PAD]  208.55,70.44 0 top
SW_Q  MX-5-PIN-HOTSWAP-PAD  [MX-5-PIN-HOTSWAP-PAD]  37.1,70.44 0 top
SW_QU  MX-5-PIN-HOTSWAP-PAD  [MX-5-PIN-HOTSWAP-PAD]  232.36,51.39 0 top
SW_R  MX-5-PIN-HOTSWAP-PAD  [MX-5-PIN-HOTSWAP-PAD]  94.25,70.44 0 top
SW_RA  MX-5-PIN-HOTSWAP-PAD  [MX-5-PIN-HOTSWAP-PAD]  199.03,13.29 0 top
SW_RC  MX-5-PIN-HOTSWAP-PAD  [MX-5-PIN-HOTSWAP-PAD]  237.12,13.29 0 top
SW_RS  MX-5-PIN-HOTSWAP-PAD  [MX-5-PIN-HOTSWAP-PAD]  249.03,32.34 0 top
SW_RT  MX-5-PIN-HOTSWAP-PAD  [MX-5-PIN-HOTSWAP-PAD]  299.04,8.53 0 top
SW_RW  MX-5-PIN-HOTSWAP-PAD  [MX-5-PIN-HOTSWAP-PAD]  218.07,13.29 0 top
SW_S  MX-5-PIN-HOTSWAP-PAD  [MX-5-PIN-HOTSWAP-PAD]  60.91,51.39 0 top
SW_SPC  MX-5-PIN-HOTSWAP-PAD  [MX-5-PIN-HOTSWAP-PAD]  129.97,13.29 0 top
SW_T  MX-5-PIN-HOTSWAP-PAD  [MX-5-PIN-HOTSWAP-PAD]  113.3,70.44 0 top
SW_TAB  MX-5-PIN-HOTSWAP-PAD  [MX-5-PIN-HOTSWAP-PAD]  13.29,70.44 0 top
SW_TDL  MX-5-PIN-HOTSWAP-PAD  [MX-5-PIN-HOTSWAP-PAD]  8.53,89.49 0 top
SW_U  MX-5-PIN-HOTSWAP-PAD  [MX-5-PIN-HOTSWAP-PAD]  151.4,70.44 0 top
SW_UP  MX-5-PIN-HOTSWAP-PAD  [MX-5-PIN-HOTSWAP-PAD]  279.99,27.57 0 top
SW_V  MX-5-PIN-HOTSWAP-PAD  [MX-5-PIN-HOTSWAP-PAD]  108.54,32.34 0 top
SW_W  MX-5-PIN-HOTSWAP-PAD  [MX-5-PIN-HOTSWAP-PAD]  56.15,70.44 0 top
SW_X  MX-5-PIN-HOTSWAP-PAD  [MX-5-PIN-HOTSWAP-PAD]  70.44,32.34 0 top
SW_Y  MX-5-PIN-HOTSWAP-PAD  [MX-5-PIN-HOTSWAP-PAD]  132.35,70.44 0 top
SW_Z  MX-5-PIN-HOTSWAP-PAD  [MX-5-PIN-HOTSWAP-PAD]  51.39,32.34 0 top
TP-3V3  TEST-POINT.3SQ  [PAD.03X.03-SQ]  155,98 0 bottom
TP-5V  TEST-POINT.3SQ  [PAD.03X.03-SQ]  161,98 0 bottom
TP-GND  TEST-POINT.3SQ  [PAD.03X.03-SQ]  158,98 0 bottom
TP-LED-EN  TEST-POINT.3SQ  [PAD.03X.03-SQ]  257.65,36.15 0 bottom
TP-USB+  TEST-POINT.3SQ  [PAD.03X.03-SQ]  344.65,103 0 bottom
TP-USB-  TEST-POINT.3SQ  [PAD.03X.03-SQ]  344.65,101.05 0 bottom
TP-V-LED-1  TEST-POINT.3SQ  [PAD.03X.03-SQ]  7.9,58.8 0 bottom
TP-V-LED-2  TEST-POINT.3SQ  [PAD.03X.03-SQ]  260.5,40.3 0 bottom
U1  STM32F411CEU7THERM  [UFQFPN-48_7X7X0P55MM-THERM]  288,61 45 bottom
U2  74HC589A_DT  [TSSOP16]  80,100 0 bottom
U3  74HC589A_DT  [TSSOP16]  223,100 0 bottom
U4  74HC589A_DT  [TSSOP16]  313,100 0 bottom
U5  IS31FL3743B  [UQFN40]  29,57 45 bottom
U6  IS31FL3743B  [UQFN40]  247.5,49.79 45 bottom
U7  TPS22995H-Q1  [SOT-23-THIN-6_DDC_TEX]  11,61 0 bottom
U8  TPS22995H-Q1  [SOT-23-THIN-6_DDC_TEX]  260.5,37.5 90 bottom
U$1  FIDUCIAL  [FIDUCIAL]  3,119 0 top
U$2  FIDUCIAL  [FIDUCIAL]  305,3 0 top
U$3  FIDUCIAL  [FIDUCIAL]  367,77 0 top
U$4  QMK_LOGO  [QMK_LOGO]  86.58,59.11 0 bottom
U$5  TECSMITH-LOGOLONG  [TECSMITH-NAME]  173.6,22.33 0 bottom
U$6  TECSMITH-LOGOLONG  [TECSMITH-NAME]  165,14 0 top
U$7  ??  [JLC_ORDER_NUMBER_QR_8X8]  360.2,9.8 0 bottom
UDB1  [MOLEX_781710004]  184.74,101 180 bottom
UDB2  [JST_SM04B-SRSS-TB_LF_SN]  342.8,102 90 bottom
Y1  32.768kHz ±20ppm 6pF  [CRYSTAL-SMD-3.2X1.5MM]  297,61 90 bottom
Y2  25MHz 9pF  [CRYSTAL_2.5X2]  289,48 180 bottom
Z1  156120M173000MILL  [156120M173000-MILL]  8.53,108.25 0 bottom
Z2  156120M173000MILL  [156120M173000-MILL]  32.34,108.25 0 bottom
Z3  156120M173000MILL  [156120M173000-MILL]  51.39,108.25 0 bottom
Z4  156120M173000MILL  [156120M173000-MILL]  70.44,108.25 0 bottom
Z5  156120M173000MILL  [156120M173000-MILL]  89.49,108.25 0 bottom
Z6  156120M173000MILL  [156120M173000-MILL]  113.3,108.25 0 bottom
Z7  156120M173000MILL  [156120M173000-MILL]  132.35,108.25 0 bottom
Z8  156120M173000MILL  [156120M173000-MILL]  151.4,108.25 0 bottom
Z9  156120M173000MILL  [156120M173000-MILL]  170.45,108.25 0 bottom
Z10  156120M173000MILL  [156120M173000-MILL]  194.26,108.25 0 bottom
Z11  156120M173000MILL  [156120M173000-MILL]  213.31,108.25 0 bottom
Z12  156120M173000MILL  [156120M173000-MILL]  232.36,108.25 0 bottom
Z13  156120M173000MILL  [156120M173000-MILL]  251.41,108.25 0 bottom
Z14  156120M173000MILL  [156120M173000-MILL]  275.23,108.25 0 bottom
Z15  156120M173000MILL  [156120M173000-MILL]  303.8,108.25 0 bottom
Z16  156120M173000MILL  [156120M173000-MILL]  322.85,108.25 0 bottom
Z17  156120M173000MILL  [156120M173000-MILL]  341.9,108.25 0 bottom
Z18  156120M173000MILL  [156120M173000-MILL]  360.95,108.25 0 bottom
Z19  DNP  [156120M173000-MILL]  8.53,84.44 0 bottom
Z20  156120M173000MILL  [156120M173000-MILL]  27.57,84.44 0 bottom
Z21  156120M173000MILL  [156120M173000-MILL]  46.62,84.44 0 bottom
Z22  156120M173000MILL  [156120M173000-MILL]  65.67,84.44 0 bottom
Z23  156120M173000MILL  [156120M173000-MILL]  84.72,84.44 0 bottom
Z24  156120M173000MILL  [156120M173000-MILL]  103.78,84.44 0 bottom
Z25  156120M173000MILL  [156120M173000-MILL]  122.83,84.44 0 bottom
Z26  156120M173000MILL  [156120M173000-MILL]  141.88,84.44 0 bottom
Z27  156120M173000MILL  [156120M173000-MILL]  160.93,84.44 0 bottom
Z28  156120M173000MILL  [156120M173000-MILL]  179.97,84.44 0 bottom
Z29  156120M173000MILL  [156120M173000-MILL]  199.03,84.44 0 bottom
Z30  156120M173000MILL  [156120M173000-MILL]  218.07,84.44 0 bottom
Z31  156120M173000MILL  [156120M173000-MILL]  237.12,84.44 0 bottom
Z32  156120M173000MILL  [156120M173000-MILL]  265.7,84.44 0 bottom
Z33  156120M173000MILL  [156120M173000-MILL]  303.8,84.44 0 bottom
Z34  156120M173000MILL  [156120M173000-MILL]  322.85,84.44 0 bottom
Z35  156120M173000MILL  [156120M173000-MILL]  341.9,84.44 0 bottom
Z36  156120M173000MILL  [156120M173000-MILL]  360.95,84.44 0 bottom
Z37  156120M173000MILL  [156120M173000-MILL]  13.29,65.39 0 bottom
Z38  156120M173000MILL  [156120M173000-MILL]  37.1,65.39 0 bottom
Z39  156120M173000MILL  [156120M173000-MILL]  56.15,65.39 0 bottom
Z40  156120M173000MILL  [156120M173000-MILL]  75.2,65.39 0 bottom
Z41  156120M173000MILL  [156120M173000-MILL]  94.25,65.39 0 bottom
Z42  156120M173000MILL  [156120M173000-MILL]  113.3,65.39 0 bottom
Z43  156120M173000MILL  [156120M173000-MILL]  132.35,65.39 0 bottom
Z44  156120M173000MILL  [156120M173000-MILL]  151.4,65.39 0 bottom
Z45  156120M173000MILL  [156120M173000-MILL]  170.45,65.39 0 bottom
Z46  156120M173000MILL  [156120M173000-MILL]  189.5,65.39 0 bottom
Z47  156120M173000MILL  [156120M173000-MILL]  208.55,65.39 0 bottom
Z48  156120M173000MILL  [156120M173000-MILL]  227.6,65.39 0 bottom
Z49  156120M173000MILL  [156120M173000-MILL]  246.65,65.39 0 bottom
Z50  156120M173000MILL  [156120M173000-MILL]  270.46,65.39 0 bottom
Z51  156120M173000MILL  [156120M173000-MILL]  303.8,65.39 0 bottom
Z52  156120M173000MILL  [156120M173000-MILL]  322.85,65.39 0 bottom
Z53  156120M173000MILL  [156120M173000-MILL]  341.9,65.39 0 bottom
Z54  156120M173000MILL  [156120M173000-MILL]  355.87,60.91 90 bottom
Z55  156120M173000MILL  [156120M173000-MILL]  15.67,46.34 0 bottom
Z56  156120M173000MILL  [156120M173000-MILL]  41.86,46.34 0 bottom
Z57  156120M173000MILL  [156120M173000-MILL]  60.91,46.34 0 bottom
Z58  156120M173000MILL  [156120M173000-MILL]  79.96,46.34 0 bottom
Z59  156120M173000MILL  [156120M173000-MILL]  99.01,46.34 0 bottom
Z60  156120M173000MILL  [156120M173000-MILL]  118.06,46.34 0 bottom
Z61  156120M173000MILL  [156120M173000-MILL]  137.11,46.34 0 bottom
Z62  156120M173000MILL  [156120M173000-MILL]  156.16,46.34 0 bottom
Z63  156120M173000MILL  [156120M173000-MILL]  175.21,46.34 0 bottom
Z64  156120M173000MILL  [156120M173000-MILL]  194.26,46.34 0 bottom
Z65  156120M173000MILL  [156120M173000-MILL]  213.31,46.34 0 bottom
Z66  156120M173000MILL  [156120M173000-MILL]  232.36,46.34 0 bottom
Z67  156120M173000MILL  [156120M173000-MILL]  263.32,46.34 0 bottom
Z68  156120M173000MILL  [156120M173000-MILL]  303.8,46.34 0 bottom
Z69  156120M173000MILL  [156120M173000-MILL]  322.85,46.34 0 bottom
Z70  156120M173000MILL  [156120M173000-MILL]  341.9,46.34 0 bottom
Z71  156120M173000MILL  [156120M173000-MILL]  20.43,27.29 0 bottom
Z72  156120M173000MILL  [156120M173000-MILL]  51.39,27.29 0 bottom
Z73  156120M173000MILL  [156120M173000-MILL]  70.44,27.29 0 bottom
Z74  156120M173000MILL  [156120M173000-MILL]  89.49,27.29 0 bottom
Z75  156120M173000MILL  [156120M173000-MILL]  108.54,27.29 0 bottom
Z76  156120M173000MILL  [156120M173000-MILL]  127.59,27.29 0 bottom
Z77  156120M173000MILL  [156120M173000-MILL]  146.64,27.29 0 bottom
Z78  156120M173000MILL  [156120M173000-MILL]  165.69,27.29 0 bottom
Z79  156120M173000MILL  [156120M173000-MILL]  184.74,27.29 0 bottom
Z80  156120M173000MILL  [156120M173000-MILL]  203.79,27.29 0 bottom
Z81  156120M173000MILL  [156120M173000-MILL]  222.84,27.29 0 bottom
Z82  156120M173000MILL  [156120M173000-MILL]  249.03,27.29 0 bottom
Z83  156120M173000MILL  [156120M173000-MILL]  279.99,22.52 0 bottom
Z84  156120M173000MILL  [156120M173000-MILL]  303.8,27.29 0 bottom
Z85  156120M173000MILL  [156120M173000-MILL]  322.85,27.29 0 bottom
Z86  156120M173000MILL  [156120M173000-MILL]  341.9,27.29 0 bottom
Z87  156120M173000MILL  [156120M173000-MILL]  355.87,22.81 90 bottom
Z88  156120M173000MILL  [156120M173000-MILL]  10.91,8.24 0 bottom
Z89  156120M173000MILL  [156120M173000-MILL]  34.72,8.24 0 bottom
Z90  156120M173000MILL  [156120M173000-MILL]  58.53,8.24 0 bottom
Z91  156120M173000MILL  [156120M173000-MILL]  129.97,8.24 0 bottom
Z92  156120M173000MILL  [156120M173000-MILL]  199.03,8.24 0 bottom
Z93  156120M173000MILL  [156120M173000-MILL]  218.07,8.24 0 bottom
Z94  156120M173000MILL  [156120M173000-MILL]  237.12,8.24 330 bottom
Z95  156120M173000MILL  [156120M173000-MILL]  260.94,3.47 0 bottom
Z96  156120M173000MILL  [156120M173000-MILL]  279.99,3.47 0 bottom
Z97  156120M173000MILL  [156120M173000-MILL]  299.04,3.47 0 bottom
Z98  156120M173000MILL  [156120M173000-MILL]  322.85,8.24 0 bottom
Z99  156120M173000MILL  [156120M173000-MILL]  341.9,8.24 0 bottom
Z101  156120M173000MILL  [156120M173000-MILL]  289.51,97.66 0 bottom
Z102  156120M173000MILL  [156120M173000-MILL]  289.51,86.81 30 bottom
Z103  156120M173000MILL  [156120M173000-MILL]  289.51,76.29 0 bottom
Z104  156120M173000MILL  [156120M173000-MILL]  91.87,8.24 0 bottom
Z105  156120M173000MILL  [156120M173000-MILL]  110.92,8.24 330 bottom
Z106  156120M173000MILL  [156120M173000-MILL]  149.02,8.24 0 bottom
Z107  156120M173000MILL  [156120M173000-MILL]  168.07,8.24 0 bottom

## Tracks (layer width: path | path; a pad name or v marks a point on that pad's centre or on a via)
!BOOT  (via drill 0.35)
  Top 0.254: S1.3 89.33,11.13 94.41,11.13 S1.4 94.68,11.4 v97.7,11.4 98.38,11.4 100.28,13.3 RST.2
  Bottom 0.254: Q6.1 99.35,13.8 97.75,13.8 R28.2 v97.7,11.4
!RESET  (via drill 0.35)
  Top 0.254: v291.85,56.42 291.6,56.42 291.26,56.08 288.73,56.08 288.25,55.6 284.02,55.6 282.48,57.15 280.71,57.15 280.48,56.92 v279.9,56.92 | v120,40.42 121.58,42 198.22,42 198.5,42.27 v199.1,42.27 | v92.47,19.12 93.67,19.12 93.92,18.88 112.95,18.88 113.33,19.25 v113.92,19.25 | v212.58,62.36 213.21,63 222.43,63 224.18,61.25 229.47,61.25 231.22,63 242.28,63 243.73,61.54 248.62,61.54 249.65,62.58 253.05,62.58 254.14,61.49 259.94,61.49 v260.25,61.8
  Bottom 0.254: U1.7 291.85,56.8 v291.85,56.42 | v120,40.42 120,40.23 116.58,36.8 116.58,21.5 114.7,19.63 114.3,19.63 v113.92,19.25 | v279.9,56.92 278.67,56.92 277.38,55.63 273.45,55.63 272.24,56.83 272.24,58.04 271.16,59.12 268.36,59.12 267.69,59.8 267.69,60.85 266.75,61.79 263.31,61.79 262.25,60.73 261.33,60.73 v260.25,61.8 | R25.2 90.17,18.5 C30.2 91.88,18.52 v92.47,19.12 | v199.1,42.27 199.78,42.27 202.5,45 202.5,55.2 208.49,61.19 211.4,61.19 v212.58,62.36
AUX_CS  (via drill 0.35)
  Top 0.254: v282.57,53.17 282.57,52 282.83,51.75 283.61,50.97 283.61,47.08 280.99,44.46 v280.99,44.1 | JSPI.5 301.06,19.95 301.75,19.95 302.26,20.46 303.12,20.46 303.8,21.13 306.07,21.13 307.43,19.77 308.83,19.77 v308.88,19.72
  Bottom 0.254: U1.19 283.4,56.75 283.4,55.33 282.57,54.5 v282.57,53.17 | JSPI.5 300.29,18.18 299.66,17.55 294.18,17.55 291.64,20.09 291.64,23.66 291.5,23.8 291.5,35.2 288.6,38.1 284.84,38.1 281.87,41.08 281.87,41.29 280.51,42.64 280.51,43.62 v280.99,44.1 | JPWM.4 309.69,10.69 309.69,12.53 309.2,13.02 309.2,19.41 v308.88,19.72
AUX_DC  (via drill 0.35)
  Top 0.254: v288.95,53.05 289.75,53.05 292.48,50.32 292.48,46.82 294.56,44.73 297.48,44.73 299,43.21 299.84,43.21 301.17,41.88 305,41.88 305.8,41.08 308.13,41.08 308.63,41.59 309.71,41.59 311.9,39.4 311.9,26.71 311.39,26.2 311.39,25.04 v311.8,24.62 | JSPI@2.1 302.85,19.48 304,20.64 305.86,20.64 307.44,19.05 308.14,19.05 v308.19,19
  Bottom 0.254: U1.11 289.45,56.37 289.45,54.65 288.95,54.15 v288.95,53.05 | JPWM.3 309.69,13.23 309.69,17.64 310.11,18.05 310.11,18.99 311.21,20.1 v311.21,20.61 | v311.8,24.62 311.8,24.1 312.06,23.84 312.06,21.93 311.21,21.09 v311.21,20.61 | v308.19,19 v308.19,19.01 308.14,19.06 308.14,20.03 308.57,20.47 310.54,20.47 310.68,20.61 v311.21,20.61
BLU1  (via drill 0.35)
  Top 0.203: v37.52,82.28 38.09,82.28 38.3,82.07 44.06,82.07 44.61,81.52 50.3,81.52 50.6,81.22 v51.35,81.22 51.94,81.22 52.77,82.05 63.99,82.05 64.8,81.24 67.13,81.24 67.78,81.89 83.14,81.89 83.8,81.24 86.15,81.24 86.71,81.8 101.74,81.8 102.3,81.24 105.27,81.24 105.83,81.8 120.37,81.8 120.93,81.24 126.85,81.24 127.41,81.8 129.19,81.8 131.47,84.06 v132.5,84.06 | v14.4,104.98 15.02,104.98 15.28,104.72 25.25,104.72 25.6,104.37 36,104.37 36.27,104.65 v36.88,104.65 37.45,104.65 37.73,104.37 53.38,104.37 53.65,104.65 v54.3,104.65 54.85,104.65 55.12,104.37 71.67,104.37 71.95,104.65 v72.61,104.65 74.83,104.65 76.42,106.25 83.68,106.25 85.5,104.42 92.67,104.42 93,104.74 v93.59,104.74 v93.6,104.75 93.62,104.77 96.88,104.77 97.55,104.1 117.62,104.1 117.93,104.4 v118.58,104.4 119.2,104.4 119.5,104.1 134.46,104.1 134.75,104.39 v135.25,104.39 135.77,104.39 136.06,104.1 145.75,104.1 146.43,104.77 148.85,104.77 149.33,104.3 155.21,104.3 v156.54,105.62 157.54,105.62 158.4,104.77 168.05,104.77 168.55,105.27 172.27,105.27 v173,106
  Bottom 0.203: R6.8 47.2,64.35 46.13,65.42 46.13,66.88 47.33,68.08 47.33,77.97 48.02,78.66 48.85,78.66 51.35,81.16 v51.35,81.22 | v37.52,82.28 37.16,82.64 37.16,103.72 36.88,104 v36.88,104.65 36.88,105.35 37.15,105.62 37.15,106.85 36.55,107.45 Z2.2 | Z1.2 11.93,107.45 v14.4,104.98 | Z3.2 54.1,107.45 54.3,107.25 v54.3,104.65 | v118.58,104.4 118.58,105.55 116.67,107.45 Z6.2 | v156.54,105.62 154.71,107.45 Z8.2 | Z9.2 173.15,107.45 173.38,107.22 173.38,106.38 v173,106 | Z4.2 73.1,107.45 73.38,107.17 73.38,105.41 v72.61,104.65 | Z5.2 92.55,107.45 93.6,106.4 v93.6,104.75 | Z7.2 135.03,107.45 135.25,107.22 v135.25,104.39 132.19,101.33 132.19,84.92 132.5,84.61 v132.5,84.06
BLU2  (via drill 0.35)
  Top 0.203: v11.57,80.95 12.19,80.95 12.47,80.66 24.7,80.66 25.07,80.28 28.62,80.28 28.99,80.66 29.57,80.66 29.85,80.94 v30.5,80.94 31.1,80.94 31.38,80.66 41.87,80.66 42.37,80.16 46.84,80.16 47.12,79.88 v47.9,79.88 48.58,79.88 48.88,79.57 52.18,79.57 53.32,80.71 63.42,80.71 64.23,79.9 67.68,79.9 67.96,80.19 v68.6,80.19 69.17,80.19 69.55,80.56 82.59,80.56 83.25,79.9 86.7,79.9 86.98,80.19 v87.6,80.19 88.15,80.19 88.43,80.46 101.19,80.46 101.75,79.9 105.83,79.9 106.11,80.19 v106.7,80.19 107.29,80.19 107.57,80.46 119.82,80.46 120.38,79.9 127.4,79.9 127.69,80.19 v128.28,80.19 128.82,80.19 129.1,80.46 140.67,80.46 141.23,79.9 143.8,79.9 144.09,80.19 v144.82,80.19 145.45,80.19 145.73,80.46 159.79,80.46 160.07,80.19 v163.85,80.19 164.52,80.19 164.8,79.9 169.39,79.9 170.14,80.66 175.33,80.66 176.39,81.72 177.88,81.72 178.4,81.2 181.25,81.2 183.07,83.03 v183.07,83.62
  Bottom 0.203: R6.6 45.6,64.38 45.24,64.73 45.24,67.27 46.44,68.47 46.44,78.42 v47.9,79.88 49.52,81.5 49.52,83.42 49.31,83.64 Z21.2 | Z24.2 106.46,83.64 106.7,83.4 v106.7,80.19 | Z23.2 87.39,83.64 87.6,83.42 v87.6,80.19 | Z22.2 68.39,83.64 68.6,83.42 v68.6,80.19 | Z25.2 125.51,83.64 128.28,80.88 v128.28,80.19 | Z20.2 30.29,83.64 30.5,83.42 v30.5,80.94 | Z28.2 183.06,83.64 v183.07,83.62 | Z27.2 163.61,83.64 163.85,83.4 v163.85,80.19 | Z26.2 144.59,83.64 144.82,83.4 v144.82,80.19
  Bottom 0.254: Z19.2 11.29,83.64 11.57,83.35 v11.57,80.95
BLU3  (via drill 0.35)
  Top 0.203: v40.07,42.54 40.34,42.81 42.4,42.81 43.13,42.08 47.72,42.08 51.19,45.55 51.19,46.15 51.47,46.43 51.47,47.05 51.19,47.33 v51.19,47.88 | v17.18,63.15 17.47,63.44 24.15,63.44 25.2,64.5 32.28,64.5 35.43,61.34 37.8,61.34 39.53,63.07 v40.15,63.07 40.72,63.07 41,62.79 42.04,62.79 42.81,63.56 48.34,63.56 50.01,61.89 51.2,61.89 v51.92,61.17 52.48,61.17 52.76,60.89 58.12,60.89 58.4,61.17 v59,61.17 59.57,61.17 59.85,60.89 77.28,60.89 77.55,61.17 v78.2,61.17 78.82,61.17 79.1,60.89 96.22,60.89 96.5,61.17 v97.15,61.17 97.75,61.17 98.03,60.89 115.33,60.89 115.6,61.17 v116.22,61.17 116.87,61.17 117.15,60.89 134.4,60.89 134.68,61.17 v135.32,61.17 135.95,61.17 136.22,60.89 153.38,60.89 153.65,61.17 v154.38,61.17 155.02,61.17 155.3,60.89 170.54,60.89 173.65,64 v173.65,64.6
  Bottom 0.203: R7.6 27.4,41.75 27.6,41.55 28.98,41.55 30.72,43.3 34.03,43.3 35.08,42.25 39.78,42.25 v40.07,42.54 | v51.19,47.88 51.19,48.4 50.91,48.68 50.91,50.58 51.19,50.85 51.19,59.79 51.92,60.52 v51.92,61.17 | Z38.2 39.81,64.59 40.15,64.25 v40.15,63.07 | Z37.2 16.29,64.59 17.18,63.7 v17.18,63.15 | Z39.2 58.81,64.59 59,64.4 v59,61.17 | Z40.2 77.94,64.59 78.2,64.33 v78.2,61.17 | Z41.2 96.94,64.59 97.15,64.38 v97.15,61.17 | Z45.2 173.64,64.59 v173.65,64.6 | Z42.2 115.99,64.59 116.5,64.08 116.5,62.02 116.22,61.74 v116.22,61.17 | Z43.2 135.06,64.59 135.32,64.33 v135.32,61.17 | Z44.2 154.14,64.59 154.38,64.35 v154.38,61.17
BLU4  (via drill 0.35)
  Top 0.203: v17.75,41.42 18.2,41.42 18.43,41.66 24.58,41.66 24.86,41.38 v25.78,41.38 | v43,40.45 43.6,40.45 43.89,40.75 48.32,40.75 50.49,42.92 56.61,42.92 57.07,43.37 57.82,43.37 58.95,42.25 60.58,42.25 60.75,42.07 v61.35,42.07 62.05,42.07 62.36,42.38 75,42.38 76.03,41.35 78.43,41.35 79.05,41.97 81.8,41.97 82.08,42.25 v82.67,42.25 83.25,42.25 83.53,41.97 99.85,41.97 100.12,41.69 v101.97,41.69 102.65,41.69 102.92,41.97 119,41.97 119.28,41.69 v119.92,41.69 120.53,41.69 121.31,42.47 139.1,42.47 139.38,42.75 v140.12,42.75 140.8,42.75 141.07,42.47 147.81,42.47 | 147.81,42.47 | 147.81,42.47 148.19,42.47 158.18,42.47 158.45,42.75 v159.1,42.75 159.72,42.75 160,42.47 175.34,42.47 v178.4,45.52
  Bottom 0.203: Z55.2 18.24,45.54 18.42,45.36 18.42,44.76 17.75,44.09 v17.75,41.42 | R7.8 25.8,41.4 v25.78,41.38 25.78,40.64 26.36,40.06 28.29,40.06 28.69,39.66 29.29,39.66 29.73,40.1 29.73,40.42 31.27,41.96 33.47,41.96 34.52,40.91 41.37,40.91 41.84,40.45 v43,40.45 43.71,41.16 43.71,43.04 45.07,44.4 45.07,45.18 44.71,45.54 Z56.2 | v61.35,42.07 62.33,42.07 63.75,43.5 63.75,45.38 63.59,45.54 Z57.2 | Z58.2 82.61,45.54 82.83,45.33 82.83,42.9 82.67,42.75 v82.67,42.25 | v101.97,41.69 102,41.72 102,45.3 101.76,45.54 Z59.2 | Z60.2 120.74,45.54 121,45.27 121,42.77 v119.92,41.69 | Z61.2 139.84,45.54 140.12,45.25 v140.12,42.75 | Z62.2 158.84,45.54 159.1,45.27 v159.1,42.75 | Z63.2 178.39,45.54 v178.4,45.52
BLU5  (via drill 0.35)
  Top 0.203: v10.95,31.92 11.3,31.58 11.3,30.43 14.1,27.62 16.2,27.62 16.57,27.25 16.57,24.48 17.7,23.35 21.86,23.35 24.07,25.56 v24.07,26.79 | v30.01,31.33 30.01,30.88 30.38,30.51 31.66,30.51 32.66,31.51 34.88,31.51 39.51,26.89 39.51,26.45 41.1,24.86 45.9,24.86 46.49,25.45 48.6,25.45 49.8,24.26 53.37,24.26 53.65,24.54 v54.3,24.54 54.9,24.54 55.18,24.26 60.55,24.26 61.7,25.41 67.09,25.41 67.64,24.86 68.73,24.86 69.2,24.39 73.21,24.39 73.92,25.11 v73.92,25.14 74.3,25.51 74.69,25.51 77.26,28.09 82.74,28.09 84.41,26.41 85.31,26.41 86.52,25.21 86.72,25.21 87,24.93 87.58,24.93 88.13,24.38 92.17,24.38 v93,25.21 95.47,25.21 95.75,24.93 102.65,24.93 103.2,25.48 106.12,25.48 107.23,24.38 110.92,24.38 111.23,24.68 v111.83,24.68 112.45,24.68 112.73,24.41 119.56,24.41 120.04,24.89 122.39,24.89 122.68,24.59 123.94,24.59 124.64,23.89 129.97,23.89 130.25,24.16 v130.85,24.16 131.45,24.16 131.73,23.89 141.71,23.89 142.26,24.44 145.13,24.44 145.63,23.93 148.72,23.93 148.98,24.19 v149.57,24.19 150.17,24.19 150.45,23.91 156.35,23.91 156.82,23.43 160.15,23.43 160.43,23.71 v160.97,23.71
  Bottom 0.203: v10.95,31.92 10.51,32.36 10.51,36.23 12.9,38.62 18.64,38.62 21.65,41.62 22.07,41.62 22.3,41.85 R8.8 | Z71.2 23.26,26.49 23.56,26.79 v24.07,26.79 24.48,27.19 24.48,27.62 28.18,31.33 v30.01,31.33 | v54.3,24.54 54.3,26.18 53.99,26.49 Z72.2 | v73.92,25.14 73.92,26.05 73.49,26.49 Z73.2 | v93,25.21 93,26 92.51,26.49 Z74.2 | v111.83,24.68 111.83,26.23 111.56,26.49 Z75.2 | v130.85,24.16 130.85,26.2 130.56,26.49 Z76.2 | v149.57,24.19 149.57,26.23 149.31,26.49 Z77.2 | v160.97,23.71 166.81,23.71 168.55,25.45 168.55,26.27 168.34,26.49 Z78.2
BLU6  (via drill 0.35)
  Top 0.203: v152.18,7.45 153.45,8.72 153.45,9.5 v154.4,10.45 | v146.22,11.91 146.22,12.51 145.39,13.34 145.39,19.46 142.97,21.88 141.33,21.88 140.98,21.53 138.77,21.53 138.42,21.88 119.97,21.88 119.7,21.6 v118.97,21.6 118.3,21.6 118,21.9 105.92,21.9 105.37,22.45 96.28,22.45 96,22.18 v95.42,22.18 94.85,22.18 94.58,21.9 87.11,21.9 86.55,22.45 84.73,22.45 81.57,25.61 78.36,25.61 74.54,21.78 68.12,21.78 67.85,22.06 v67.22,22.06 66.67,22.06 66.45,22.28 64.8,22.28 64.17,22.91 62.8,22.91 61.67,21.78 47.71,21.78 47.16,22.34 45.85,22.34 45.55,22.04 v44.95,22.04 44.33,22.04 44.02,22.34 39.97,22.34 37.03,25.28 37.03,25.86 34.41,28.48 30,28.48 29.69,28.18 v28.98,28.18 | v22.47,11.59 18.31,7.44 v14.01,7.44
  Bottom 0.203: Z106.2 152.16,7.44 v152.18,7.45 | R8.6 23.9,40.75 25.48,39.17 27.9,39.17 28.55,38.52 28.55,35.71 30.75,33.51 30.75,29.56 29.8,28.6 29.4,28.6 v28.98,28.18 28.48,27.68 28.48,27.27 25.43,24.22 25.43,14.56 v22.47,11.59 | Z88.2 v14.01,7.44 | v118.97,21.6 118.08,20.71 118.08,20 117.6,19.52 116.62,19.52 115.67,18.58 115.67,17.13 114.22,15.68 114.22,11.33 113.64,10.74 113.64,9.19 Z105.2 | Z91.2 132.71,7.44 133.29,8.01 136.14,8.01 140.74,12.61 145.52,12.61 v146.22,11.91 146.74,11.39 152.88,11.39 153.83,10.45 v154.4,10.45 154.4,9.88 154.8,9.48 162.78,9.48 164.81,11.51 169.85,11.51 171.92,9.43 171.92,8.73 171.5,8.3 171.11,8.3 170.82,8.01 170.82,7.57 170.69,7.44 Z107.2 | v95.42,22.18 95.42,21.63 95.7,21.35 95.7,15.76 96.1,15.35 96.1,9.85 94.78,8.52 94.78,7.66 94.55,7.44 Z104.2 | Z90.2 61.19,7.44 61.7,7.95 63.58,7.95 67,11.37 67,20.62 67.22,20.85 v67.22,22.06 | Z89.2 37.56,7.44 38.12,8 41.63,8 44.62,11 44.62,21.71 v44.95,22.04
BLU7  (via drill 0.35)
  Top 0.203: v206.87,104.81 207.56,104.81 207.84,104.54 214.59,104.54 214.86,104.81 v215.36,104.81 215.91,104.81 216.19,104.54 218.22,104.54 218.4,104.71 219,104.71 219.17,104.54 221.6,104.54 222.43,105.37 224.92,105.37 225.79,106.24 226.39,106.24 228.19,104.44 233.01,104.44 234.03,103.42 v235.27,103.42 235.28,103.4 239.35,103.4 240.43,102.32 243.85,102.32 244.98,103.45 245.33,103.45 246.94,105.05 250.24,105.05 250.84,104.45 253.41,104.45 253.69,104.73 v254.32,104.73 255.04,104.73 255.32,104.45 277.65,104.45 277.93,104.73 v278.5,104.73 279.87,104.73 282.34,107.2 290.42,107.2 290.98,106.63 297.31,106.63 297.91,106.03 299.64,106.03 300.46,105.22 301.47,105.22 301.97,104.72 303.3,104.72 303.39,104.62 307.13,104.62 v307.25,104.75 307.64,104.75 307.68,104.72 325.33,104.72 325.61,104.44 v326.5,104.44 327.1,104.44 327.38,104.72 343.8,104.72 344.08,104.44 v344.66,104.44 345.22,104.44 345.5,104.72 348.8,104.72 349.6,105.52 353.6,105.52 354.29,104.82 362.32,104.82 v363.25,105.75 | v257.12,74.05 258.18,74.05 258.4,74.27 260.3,74.27 261.66,75.63 262.45,75.63 263.3,76.48 v263.3,76.5 | v263.73,81.27 263.23,81.77 263.23,82.35 261.29,84.29 259.98,84.29 256.97,87.3 256.97,88.5 256.69,88.78 v256.69,89.33
  Bottom 0.203: Z18.2 363.61,107.45 363.86,107.2 363.86,106.36 v363.25,105.75 | Z17.2 344.61,107.45 344.9,107.16 344.9,105.21 344.66,104.97 v344.66,104.44 | Z10.2 196.92,107.45 197.17,107.69 197.17,108.25 197.52,108.61 203.47,108.61 206.87,105.2 v206.87,104.81 | Z11.2 216.07,107.45 216.26,107.25 216.26,106.67 215.36,105.76 v215.36,104.81 | Z12.2 235.07,107.45 235.27,107.25 v235.27,103.42 | Z13.2 254.07,107.45 254.37,107.16 254.37,104.77 v254.32,104.73 255.56,104.73 256.73,105.89 258.95,105.89 259.37,105.47 259.37,104.87 259.1,104.6 259.1,100.67 257.34,98.92 257.34,94.6 256.41,93.67 256.41,90.24 256.69,89.96 v256.69,89.33 | Z14.2 277.9,107.45 278.5,106.85 v278.5,104.73 | v326.5,104.44 326.5,106.5 325.55,107.45 Z16.2 | Z15.2 306.45,107.45 306.65,107.25 306.65,105.36 v307.25,104.75 | R9.8 256.7,66.3 256.3,66.7 256.3,68.29 256.57,68.56 256.57,69.98 257.12,70.53 v257.12,74.05 | v263.3,76.5 262.93,76.88 262.93,80.47 v263.73,81.27
BLU8  (via drill 0.35)
  Top 0.203: v363.43,80.48 362.77,80.48 362.49,80.76 360.77,80.76 359.77,79.76 358.99,79.76 358.53,79.29 345.7,79.29 345.45,79.04 v344.85,79.04 344.25,79.04 344,79.29 332.47,79.29 331.35,78.17 328.59,78.17 v328.54,78.22 | v202.12,83.67 204.14,81.66 210.84,81.66 212.08,82.91 212.08,83.28 212.5,83.7 214.16,83.7 v214.94,82.92 | v221.18,83.65 222.73,82.1 230.45,82.1 231.26,82.91 231.26,83.3 231.68,83.72 232.28,83.72 232.54,83.46 233.17,83.46 v234.13,82.5 | v240.55,83.65 242.4,83.65 242.95,83.1 246.41,83.1 v246.82,83.52 247.47,83.52 247.97,84.01 248.75,84.01 251.51,86.78 256.24,86.78 259.61,83.4 260.79,83.4 261.74,82.45 261.74,81.77 262.96,80.55 268.16,80.55 269.74,82.13 269.74,82.52 v270.15,82.93 270.53,83.31 270.92,83.31 277.11,89.5 277.11,90.37 280.16,93.42 281.54,93.42 282.01,92.94 283.82,92.94 284.8,93.92 285.82,93.92 286.08,94.17 v286.6,94.17 287.25,94.17 287.95,93.47 287.95,91.68 288.31,91.32 288.31,89.92 286.52,88.12 286.52,84.79 287.93,83.38 288.65,83.38 288.81,83.22 290.27,83.22 291.05,84 v292,84 292.01,84 292.55,84 293.83,82.7 295.04,82.7 296.72,81.02 299.5,81.02 300.3,80.22 306,80.22 306.4,80.62 v306.82,80.62 307.32,80.62 307.73,80.22 313.78,80.22 315.14,78.86 326.29,78.86 v327.08,79.66
  Bottom 0.203: Z36.2 363.66,83.64 363.9,83.39 363.9,80.96 v363.43,80.48 | Z34.2 325.5,83.64 327.18,81.96 327.18,80.72 327.07,80.62 v327.07,79.66 v327.08,79.66 328.52,78.22 v328.54,78.22 | Z33.2 306.4,83.64 307.01,84.25 307.48,84.25 307.89,83.84 307.89,80.88 307.63,80.62 v306.82,80.62 | Z29.2 202.09,83.64 v202.12,83.67 | Z30.2 221.17,83.64 v221.18,83.65 221.18,83.08 220.78,82.67 220.19,82.67 219.49,81.97 216.66,81.97 215.94,82.69 215.48,82.69 215.26,82.92 v214.94,82.92 | Z35.2 344.61,83.64 344.85,83.4 v344.85,79.04 | Z32.2 269.46,83.64 270.15,82.95 v270.15,82.93 | v286.6,94.17 287.37,94.17 288.63,92.91 290.77,92.91 291.36,93.5 Z101.2 | R9.6 255.1,66.2 255.41,66.51 255.41,68.66 255.69,68.93 255.69,70.34 256.23,70.89 256.23,73.11 255.61,73.73 255.61,76.19 254.19,77.61 251.97,77.61 247.38,82.2 247.38,83 246.87,83.52 v246.82,83.52 | v234.13,82.5 235.18,82.5 235.71,81.97 238.54,81.97 239.12,82.55 239.95,82.55 240.54,83.14 240.54,83.64 | Z31.2 240.54,83.64 | 240.54,83.64 v240.55,83.65 | Z102.2 290.81,85.19 v292,84
BLU9  (via drill 0.35)